# EAGLE design GF130_simple (EAGLE 9.5.2)
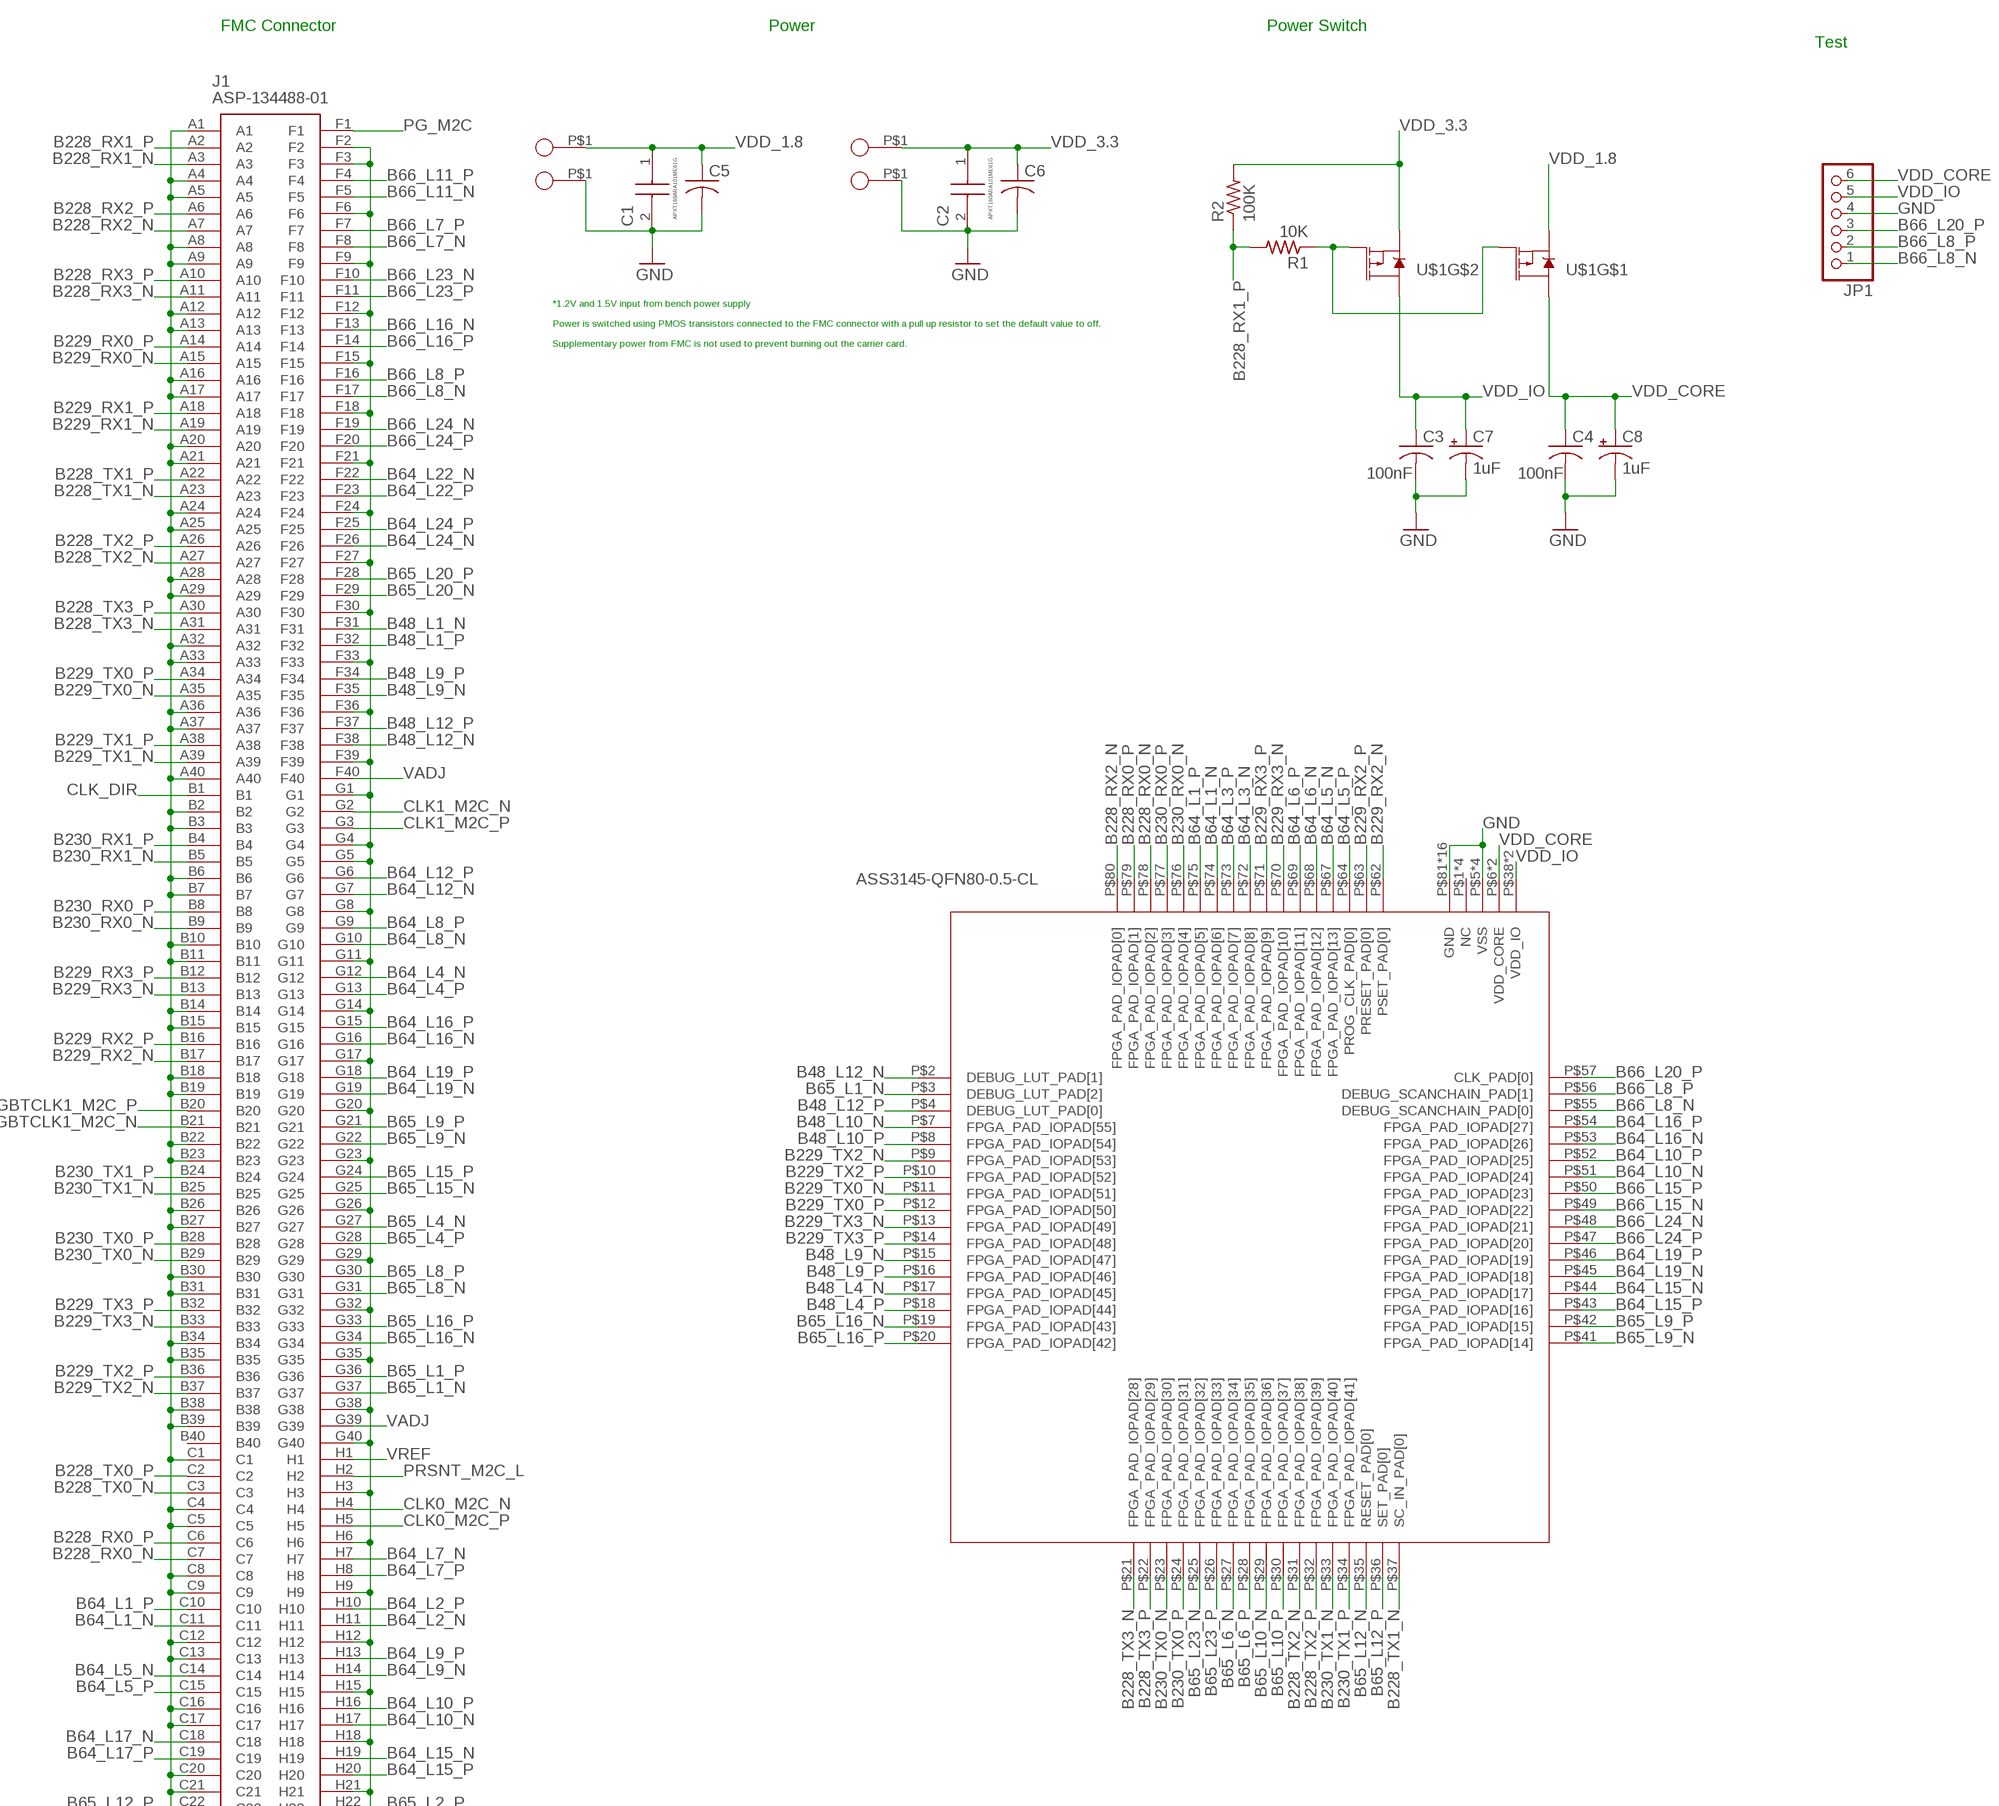
[diagram p0: schematic, sheet 1, part 1 of 2]
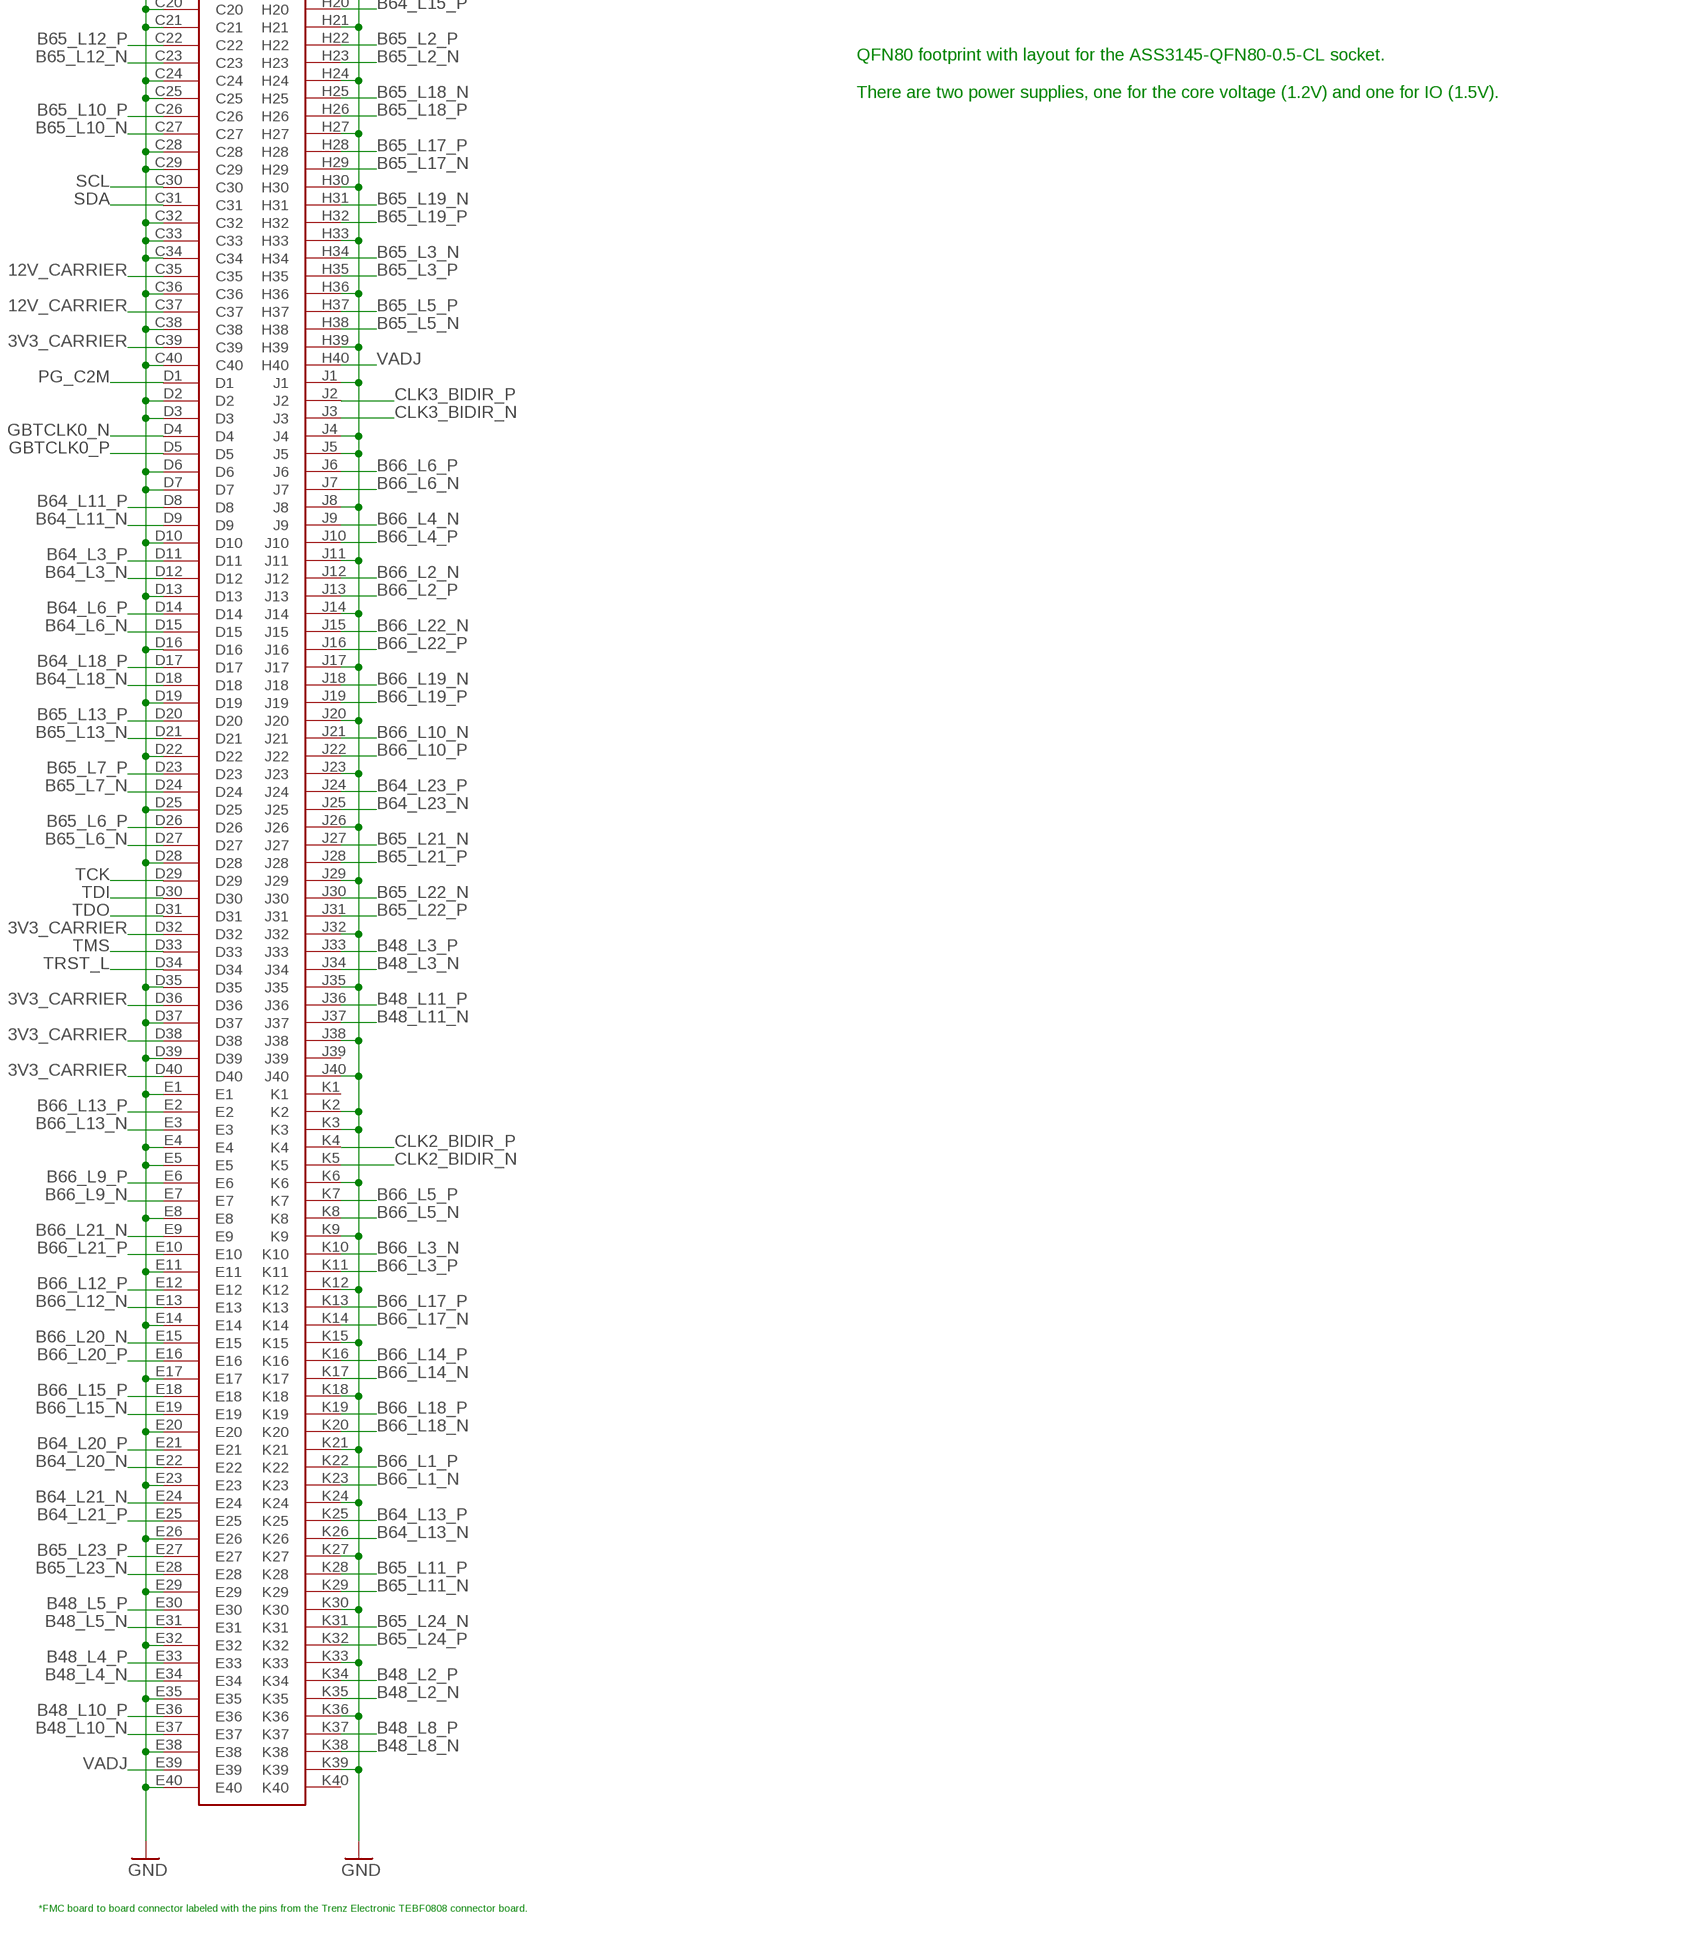
[diagram p1: schematic, sheet 1, part 2 of 2]

## Parts
C1  APXT160ARA101ME61G  [CAPAE530X610N]
C2  APXT160ARA101ME61G  [CAPAE530X610N]
C3  100nF  C-USC1210  [C1210]
C4  100nF  C-USC1210  [C1210]
C5  C-USC0805K  [C0805K]
C6  C-USC0805K  [C0805K]
C7  1uF  CPOL-USE2,5-6E  [E2,5-6E]
C8  1uF  CPOL-USE2,5-6E  [E2,5-6E]
J1  ASP-134488-01  [ASP13448801]
JP1  PINHD-1X6  [1X06]
R1  10K  R-US_R1210  [R1210]
R2  100K  R-US_R1210  [R1210]
U$1  DMP3085LSD-13  [SOIC127P600X150-8N]
U$2  QFN80  [GF130]
U$3  BANANA_JACK  [73099]
U$4  BANANA_JACK  [73099]
U$5  BANANA_JACK  [73099]
VDD  BANANA_JACK  [73099]

## Nets
3V3_CARRIER: J1.C39 J1.D32 J1.D36 J1.D38 J1.D40
12V_CARRIER: J1.C35 J1.C37
B48_L1_N: J1.F31
B48_L1_P: J1.F32
B48_L2_N: J1.K35
B48_L2_P: J1.K34
B48_L3_N: J1.J34
B48_L3_P: J1.J33
B48_L4_N: J1.E34 U$2.P$17(FPGA_PAD_IOPAD[45])
B48_L4_P: J1.E33 U$2.P$18(FPGA_PAD_IOPAD[44])
B48_L5_N: J1.E31
B48_L5_P: J1.E30
B48_L8_N: J1.K38
B48_L8_P: J1.K37
B48_L9_N: J1.F35 U$2.P$15(FPGA_PAD_IOPAD[47])
B48_L9_P: J1.F34 U$2.P$16(FPGA_PAD_IOPAD[46])
B48_L10_N: J1.E37 U$2.P$7(FPGA_PAD_IOPAD[55])
B48_L10_P: J1.E36 U$2.P$8(FPGA_PAD_IOPAD[54])
B48_L11_N: J1.J37
B48_L11_P: J1.J36
B48_L12_N: J1.F38 U$2.P$2(DEBUG_LUT_PAD[1])
B48_L12_P: J1.F37 U$2.P$4(DEBUG_LUT_PAD[0])
B64_L1_N: J1.C11 U$2.P$74(FPGA_PAD_IOPAD[6])
B64_L1_P: J1.C10 U$2.P$75(FPGA_PAD_IOPAD[5])
B64_L2_N: J1.H11
B64_L2_P: J1.H10
B64_L3_N: J1.D12 U$2.P$72(FPGA_PAD_IOPAD[8])
B64_L3_P: J1.D11 U$2.P$73(FPGA_PAD_IOPAD[7])
B64_L4_N: J1.G12
B64_L4_P: J1.G13
B64_L5_N: J1.C14 U$2.P$67(FPGA_PAD_IOPAD[13])
B64_L5_P: J1.C15 U$2.P$64(PROG_CLK_PAD[0])
B64_L6_N: J1.D15 U$2.P$68(FPGA_PAD_IOPAD[12])
B64_L6_P: J1.D14 U$2.P$69(FPGA_PAD_IOPAD[11])
B64_L7_N: J1.H7
B64_L7_P: J1.H8
B64_L8_N: J1.G10
B64_L8_P: J1.G9
B64_L9_N: J1.H14
B64_L9_P: J1.H13
B64_L10_N: J1.H17 U$2.P$51(FPGA_PAD_IOPAD[24])
B64_L10_P: J1.H16 U$2.P$52(FPGA_PAD_IOPAD[25])
B64_L11_N: J1.D9
B64_L11_P: J1.D8
B64_L12_N: J1.G7
B64_L12_P: J1.G6
B64_L13_N: J1.K26
B64_L13_P: J1.K25
B64_L15_N: J1.H19 U$2.P$44(FPGA_PAD_IOPAD[17])
B64_L15_P: J1.H20 U$2.P$43(FPGA_PAD_IOPAD[16])
B64_L16_N: J1.G16 U$2.P$53(FPGA_PAD_IOPAD[26])
B64_L16_P: J1.G15 U$2.P$54(FPGA_PAD_IOPAD[27])
B64_L17_N: J1.C18
B64_L17_P: J1.C19
B64_L18_N: J1.D18
B64_L18_P: J1.D17
B64_L19_N: J1.G19 U$2.P$45(FPGA_PAD_IOPAD[18])
B64_L19_P: J1.G18 U$2.P$46(FPGA_PAD_IOPAD[19])
B64_L20_N: J1.E22
B64_L20_P: J1.E21
B64_L21_N: J1.E24
B64_L21_P: J1.E25
B64_L22_N: J1.F22
B64_L22_P: J1.F23
B64_L23_N: J1.J25
B64_L23_P: J1.J24
B64_L24_N: J1.F26
B64_L24_P: J1.F25
B65_L1_N: J1.G37 U$2.P$3(DEBUG_LUT_PAD[2])
B65_L1_P: J1.G36
B65_L2_N: J1.H23
B65_L2_P: J1.H22
B65_L3_N: J1.H34
B65_L3_P: J1.H35
B65_L4_N: J1.G27
B65_L4_P: J1.G28
B65_L5_N: J1.H38
B65_L5_P: J1.H37
B65_L6_N: J1.D27 U$2.P$27(FPGA_PAD_IOPAD[34])
B65_L6_P: J1.D26 U$2.P$28(FPGA_PAD_IOPAD[35])
B65_L7_N: J1.D24
B65_L7_P: J1.D23
B65_L8_N: J1.G31
B65_L8_P: J1.G30
B65_L9_N: J1.G22 U$2.P$41(FPGA_PAD_IOPAD[14])
B65_L9_P: J1.G21 U$2.P$42(FPGA_PAD_IOPAD[15])
B65_L10_N: J1.C27 U$2.P$29(FPGA_PAD_IOPAD[36])
B65_L10_P: J1.C26 U$2.P$30(FPGA_PAD_IOPAD[37])
B65_L11_N: J1.K29
B65_L11_P: J1.K28
B65_L12_N: J1.C23 U$2.P$35(RESET_PAD[0])
B65_L12_P: J1.C22 U$2.P$36(SET_PAD[0])
B65_L13_N: J1.D21
B65_L13_P: J1.D20
B65_L15_N: J1.G25
B65_L15_P: J1.G24
B65_L16_N: J1.G34 U$2.P$19(FPGA_PAD_IOPAD[43])
B65_L16_P: J1.G33 U$2.P$20(FPGA_PAD_IOPAD[42])
B65_L17_N: J1.H29
B65_L17_P: J1.H28
B65_L18_N: J1.H25
B65_L18_P: J1.H26
B65_L19_N: J1.H31
B65_L19_P: J1.H32
B65_L20_N: J1.F29
B65_L20_P: J1.F28
B65_L21_N: J1.J27
B65_L21_P: J1.J28
B65_L22_N: J1.J30
B65_L22_P: J1.J31
B65_L23_N: J1.E28 U$2.P$25(FPGA_PAD_IOPAD[32])
B65_L23_P: J1.E27 U$2.P$26(FPGA_PAD_IOPAD[33])
B65_L24_N: J1.K31
B65_L24_P: J1.K32
B66_L1_N: J1.K23
B66_L1_P: J1.K22
B66_L2_N: J1.J12
B66_L2_P: J1.J13
B66_L3_N: J1.K10
B66_L3_P: J1.K11
B66_L4_N: J1.J9
B66_L4_P: J1.J10
B66_L5_N: J1.K8
B66_L5_P: J1.K7
B66_L6_N: J1.J7
B66_L6_P: J1.J6
B66_L7_N: J1.F8
B66_L7_P: J1.F7
B66_L8_N: J1.F17 JP1.1 U$2.P$55(DEBUG_SCANCHAIN_PAD[0])
B66_L8_P: J1.F16 JP1.2 U$2.P$56(DEBUG_SCANCHAIN_PAD[1])
B66_L9_N: J1.E7
B66_L9_P: J1.E6
B66_L10_N: J1.J21
B66_L10_P: J1.J22
B66_L11_N: J1.F5
B66_L11_P: J1.F4
B66_L12_N: J1.E13
B66_L12_P: J1.E12
B66_L13_N: J1.E3
B66_L13_P: J1.E2
B66_L14_N: J1.K17
B66_L14_P: J1.K16
B66_L15_N: J1.E19 U$2.P$49(FPGA_PAD_IOPAD[22])
B66_L15_P: J1.E18 U$2.P$50(FPGA_PAD_IOPAD[23])
B66_L16_N: J1.F13
B66_L16_P: J1.F14
B66_L17_N: J1.K14
B66_L17_P: J1.K13
B66_L18_N: J1.K20
B66_L18_P: J1.K19
B66_L19_N: J1.J18
B66_L19_P: J1.J19
B66_L20_N: J1.E15
B66_L20_P: J1.E16 JP1.3 U$2.P$57(CLK_PAD[0])
B66_L21_N: J1.E9
B66_L21_P: J1.E10
B66_L22_N: J1.J15
B66_L22_P: J1.J16
B66_L23_N: J1.F10
B66_L23_P: J1.F11
B66_L24_N: J1.F19 U$2.P$48(FPGA_PAD_IOPAD[21])
B66_L24_P: J1.F20 U$2.P$47(FPGA_PAD_IOPAD[20])
B228_RX0_N: J1.C7 U$2.P$78(FPGA_PAD_IOPAD[2])
B228_RX0_P: J1.C6 U$2.P$79(FPGA_PAD_IOPAD[1])
B228_RX1_N: J1.A3
B228_RX1_P: J1.A2 R1.2 R2.1
B228_RX2_N: J1.A7 U$2.P$80(FPGA_PAD_IOPAD[0])
B228_RX2_P: J1.A6
B228_RX3_N: J1.A11
B228_RX3_P: J1.A10
B228_TX0_N: J1.C3
B228_TX0_P: J1.C2
B228_TX1_N: J1.A23 U$2.P$37(SC_IN_PAD[0])
B228_TX1_P: J1.A22
B228_TX2_N: J1.A27 U$2.P$31(FPGA_PAD_IOPAD[38])
B228_TX2_P: J1.A26 U$2.P$32(FPGA_PAD_IOPAD[39])
B228_TX3_N: J1.A31 U$2.P$21(FPGA_PAD_IOPAD[28])
B228_TX3_P: J1.A30 U$2.P$22(FPGA_PAD_IOPAD[29])
B229_RX0_N: J1.A15
B229_RX0_P: J1.A14
B229_RX1_N: J1.A19
B229_RX1_P: J1.A18
B229_RX2_N: J1.B17 U$2.P$62(PSET_PAD[0])
B229_RX2_P: J1.B16 U$2.P$63(PRESET_PAD[0])
B229_RX3_N: J1.B13 U$2.P$70(FPGA_PAD_IOPAD[10])
B229_RX3_P: J1.B12 U$2.P$71(FPGA_PAD_IOPAD[9])
B229_TX0_N: J1.A35 U$2.P$11(FPGA_PAD_IOPAD[51])
B229_TX0_P: J1.A34 U$2.P$12(FPGA_PAD_IOPAD[50])
B229_TX1_N: J1.A39
B229_TX1_P: J1.A38
B229_TX2_N: J1.B37 U$2.P$9(FPGA_PAD_IOPAD[53])
B229_TX2_P: J1.B36 U$2.P$10(FPGA_PAD_IOPAD[52])
B229_TX3_N: J1.B33 U$2.P$13(FPGA_PAD_IOPAD[49])
B229_TX3_P: J1.B32 U$2.P$14(FPGA_PAD_IOPAD[48])
B230_RX0_N: J1.B9 U$2.P$76(FPGA_PAD_IOPAD[4])
B230_RX0_P: J1.B8 U$2.P$77(FPGA_PAD_IOPAD[3])
B230_RX1_N: J1.B5
B230_RX1_P: J1.B4
B230_TX0_N: J1.B29 U$2.P$23(FPGA_PAD_IOPAD[30])
B230_TX0_P: J1.B28 U$2.P$24(FPGA_PAD_IOPAD[31])
B230_TX1_N: J1.B25 U$2.P$33(FPGA_PAD_IOPAD[40])
B230_TX1_P: J1.B24 U$2.P$34(FPGA_PAD_IOPAD[41])
CLK0_M2C_N: J1.H4
CLK0_M2C_P: J1.H5
CLK1_M2C_N: J1.G2
CLK1_M2C_P: J1.G3
CLK2_BIDIR_N: J1.K5
CLK2_BIDIR_P: J1.K4
CLK3_BIDIR_N: J1.J3
CLK3_BIDIR_P: J1.J2
CLK_DIR: J1.B1
GBTCLK0_N: J1.D4
GBTCLK0_P: J1.D5
GBTCLK1_M2C_N: J1.B21
GBTCLK1_M2C_P: J1.B20
GND: C1.2(-) C2.2(-) C3.2 C4.2 C5.2 C6.2 C7.- C8.- J1.A1 J1.A4 J1.A5 J1.A8 J1.A9 J1.A12 J1.A13 J1.A16 J1.A17 J1.A20 J1.A21 J1.A24 J1.A25 J1.A28 J1.A29 J1.A32 J1.A33 J1.A36 J1.A37 J1.A40 J1.B2 J1.B3 J1.B6 J1.B7 J1.B10 J1.B11 J1.B14 J1.B15 J1.B18 J1.B19 J1.B22 J1.B23 J1.B26 J1.B27 J1.B30 J1.B31 J1.B34 J1.B35 J1.B38 J1.B39 J1.C1 J1.C4 J1.C5 J1.C8 J1.C9 J1.C12 J1.C13 J1.C16 J1.C17 J1.C20 J1.C21 J1.C24 J1.C25 J1.C28 J1.C29 J1.C32 J1.C33 J1.C34 J1.C36 J1.C38 J1.C40 J1.D2 J1.D3 J1.D6 J1.D7 J1.D10 J1.D13 J1.D16 J1.D19 J1.D22 J1.D25 J1.D28 J1.D35 J1.D37 J1.D39 J1.E1 J1.E4 J1.E5 J1.E8 J1.E11 J1.E14 J1.E17 J1.E20 J1.E23 J1.E26 J1.E29 J1.E32 J1.E35 J1.E38 J1.E40 J1.F2 J1.F3 J1.F6 J1.F9 J1.F12 J1.F15 J1.F18 J1.F21 J1.F24 J1.F27 J1.F30 J1.F33 J1.F36 J1.F39 J1.G1 J1.G4 J1.G5 J1.G8 J1.G11 J1.G14 J1.G17 J1.G20 J1.G23 J1.G26 J1.G29 J1.G32 J1.G35 J1.G38 J1.G40 J1.H3 J1.H6 J1.H9 J1.H12 J1.H15 J1.H18 J1.H21 J1.H24 J1.H27 J1.H30 J1.H33 J1.H36 J1.H39 J1.J1 J1.J4 J1.J5 J1.J8 J1.J11 J1.J14 J1.J17 J1.J20 J1.J23 J1.J26 J1.J29 J1.J32 J1.J35 J1.J38 J1.J40 J1.K2 J1.K3 J1.K6 J1.K9 J1.K12 J1.K15 J1.K18 J1.K21 J1.K24 J1.K27 J1.K30 J1.K33 J1.K36 J1.K39 JP1.4 U$2.P$5(VSS) U$2.P$39(VSS) U$2.P$59(VSS) U$2.P$65(VSS) U$2.P$81(GND) U$2.P$82(GND) U$2.P$83(GND) U$2.P$84(GND) U$2.P$85(GND) U$2.P$86(GND) U$2.P$87(GND) U$2.P$88(GND) U$2.P$89(GND) U$2.P$90(GND) U$2.P$91(GND) U$2.P$92(GND) U$2.P$93(GND) U$2.P$94(GND) U$2.P$95(GND) U$2.P$96(GND) U$3.P$1 U$5.P$1
N$2: R1.1 U$1.2(G) U$1.4(G)
PG_C2M: J1.D1
PG_M2C: J1.F1
PRSNT_M2C_L: J1.H2
SCL: J1.C30
SDA: J1.C31
TCK: J1.D29
TDI: J1.D30
TDO: J1.D31
TMS: J1.D33
TRST_L: J1.D34
VADJ: J1.E39 J1.F40 J1.G39 J1.H40
VDD_1.8: C1.1(+) C5.1 U$1.1(S) VDD.P$1
VDD_3.3: C2.1(+) C6.1 R2.2 U$1.3(S) U$4.P$1
VDD_CORE: C4.1 C8.+ JP1.6 U$1.7(D) U$1.8(D) U$2.P$6(VDD_CORE) U$2.P$58(VDD_CORE)
VDD_IO: C3.1 C7.+ JP1.5 U$1.5(D) U$1.6(D) U$2.P$38(VDD_IO) U$2.P$66(VDD_IO)
VREF: J1.H1
Unconnected: J1.B40 J1.J39 J1.K1 J1.K40 U$2.P$1(NC) U$2.P$40(NC) U$2.P$60(NC) U$2.P$61(NC)

## Notes on the sheet
- FMC Connector | Power | Power Switch
- Test
- *1.2V and 1.5V input from bench power supply
  
  Power is switched using PMOS transistors connected to the FMC connector with a pull up resistor to set the default value to off.
  
  Supplementary power from FMC is not used to prevent burning out the carrier card.
- QFN80 footprint with layout for the ASS3145-QFN80-0.5-CL socket. 
  
  There are two power supplies, one for the core voltage (1.2V) and one for IO (1.5V).
- *FMC board to board connector labeled with the pins from the Trenz Electronic TEBF0808 connector board.

## Power pins joined to a net without a drawn wire
GND: U$3.P$2(GND) U$3.P$3(GND) U$3.P$4(GND) U$3.P$5(GND) U$4.P$2(GND) U$4.P$3(GND) U$4.P$4(GND) U$4.P$5(GND) U$5.P$2(GND) U$5.P$3(GND) U$5.P$4(GND) U$5.P$5(GND) VDD.P$2(GND) VDD.P$3(GND) VDD.P$4(GND) VDD.P$5(GND)

## Library data of the parts
C1 C2 = SamacSys_Parts:APXT160ARA101ME61G: Aluminum Organic Polymer Capacitors 100uF 16V Source: Datasheet; DESCRIPTION: Aluminum Organic Polymer Capacitors 100uF 16V; HEIGHT: 6.1mm; MANUFACTURER_NAME: United Chemi-Con; MANUFACTURER_PART_NUMBER: APXT160ARA101ME61G; MOUSER_PART_NUMBER: 661-APXT160A101ME61G; MOUSER_PRICE-STOCK: https://www.mouser.co.uk/ProductDetail/United-Chemi-Con/APXT160ARA101ME61G?qs=GBLSl2Akirsip577GuQBxg%3D%3D
C3-C6 = rcl:C-US: CAPACITOR, American symbol; SPICEPREFIX: C
C7 C8 = rcl:CPOL-US: POLARIZED CAPACITOR, American symbol; SPICEPREFIX: C
J1 = SamacSys_Parts:ASP-134488-01: SAMTEC - ASP-134488-01 - CONN, VITA 57 FMC, HEADER, 400POS, 10ROW Source: Datasheet <http://suddendocs.samtec.com/prints/asp-134488-01-mkt.pdf>; DESCRIPTION: SAMTEC - ASP-134488-01 - CONN, VITA 57 FMC, HEADER, 400POS, 10ROW; HEIGHT: 7.11mm; MANUFACTURER_NAME: SAMTEC; MANUFACTURER_PART_NUMBER: ASP-134488-01; MOUSER_PART_NUMBER: 200-ASP-134488-01; MOUSER_PRICE-STOCK: https://www.mouser.co.uk/ProductDetail/Samtec/ASP-134488-01?qs=jyzYFa4oMQiB2Frr%252B13AUg%3D%3D
JP1 = adafruit:PINHD-1X6: PIN HEADER
R1 R2 = rcl:R-US_: RESISTOR, American symbol; SPICEPREFIX: R
U$1 = DMP3085LSD:DMP3085LSD-13
U$2 = ASS3145-QFN80-0.5-CL:QFN80
U$3-U$5 VDD = 73099:BANANA_JACK

## Board
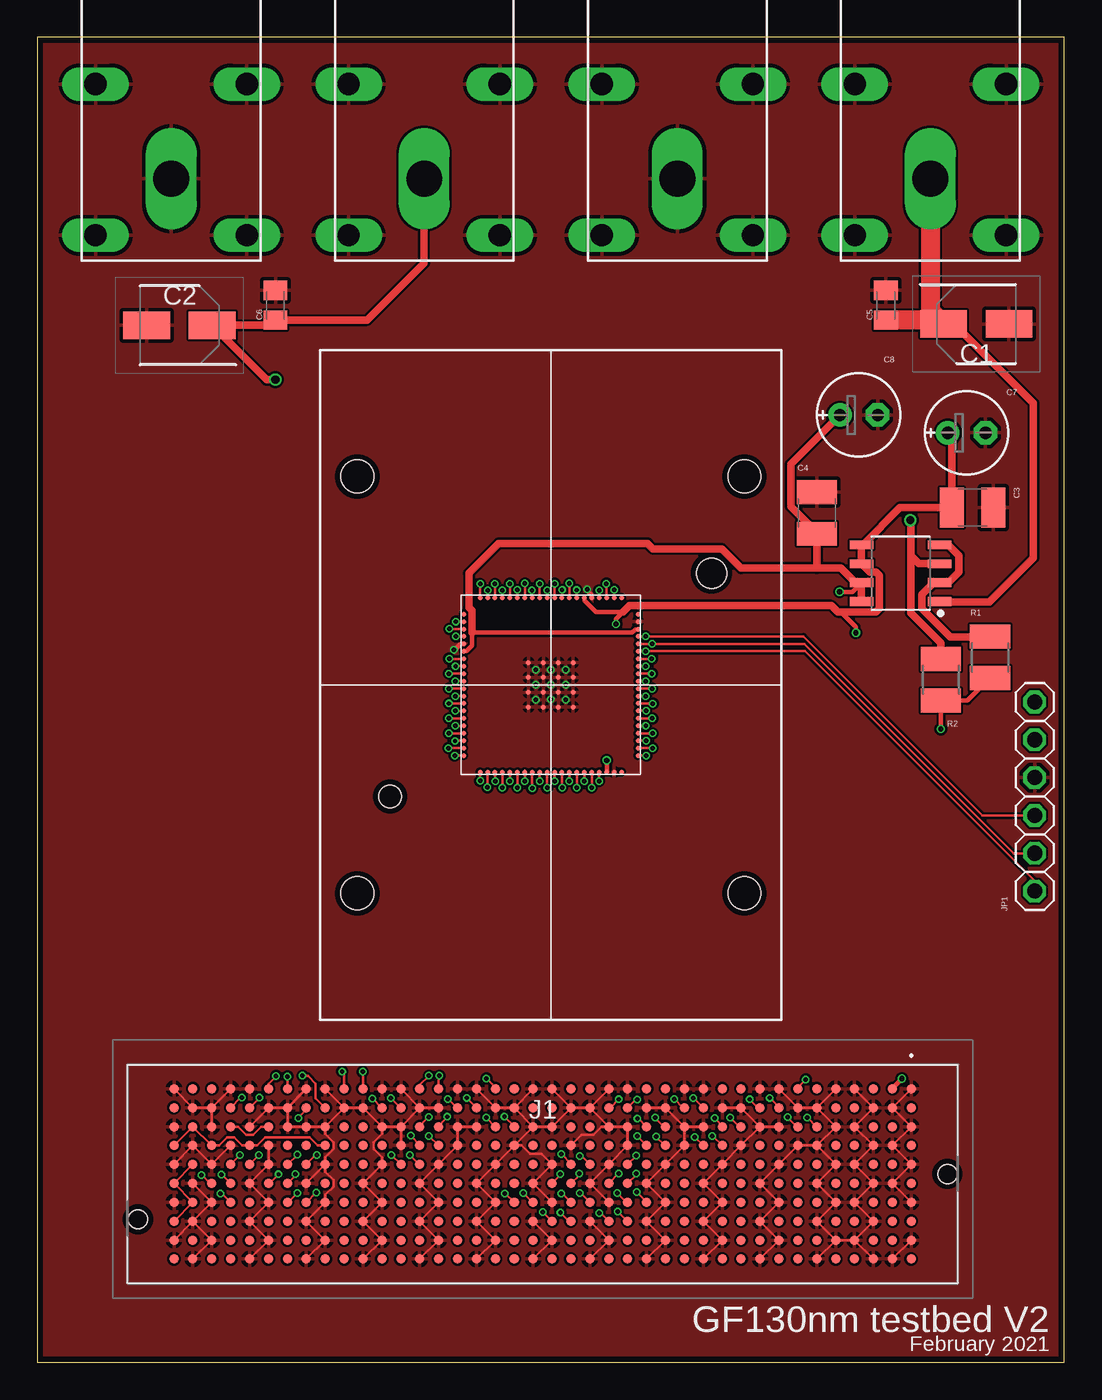
[diagram p2: board, top side]
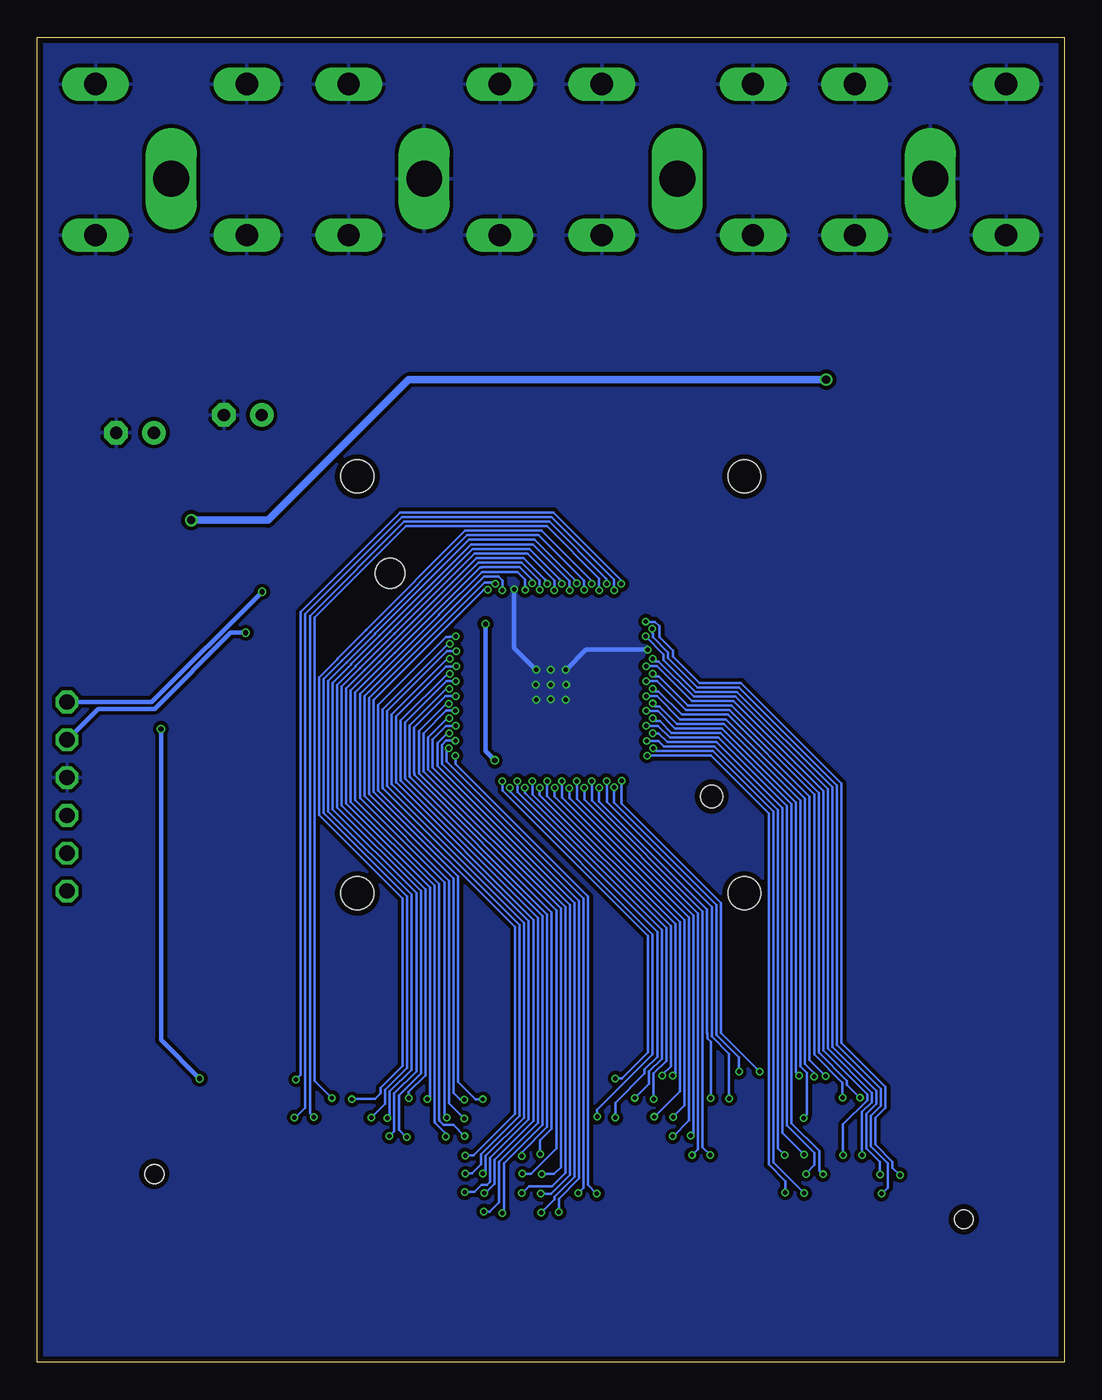
[diagram p3: board, bottom side, seen from below]

Size 69 x 89 mm. Coordinates in mm from the lower left corner, seen from the top.
Outline: 69,89 0,89 0,0 69,0 69,89
Copper layers (1*2+15*16): Top 0.0356mm / dielectric 0.1702mm / Route2 0.0178mm / dielectric 47mil / Route15 0.0178mm / dielectric 0.1702mm / Bottom 0.0356mm
Design rules "default *": minimum track width 4mil, minimum drill 0.3mm, track to track 6mil, track to pad 6mil, pad to pad 6mil, via to via 6mil, smd to smd 0mil, copper to edge 15mil, drill to drill 6mil, minimum pad ring 6mil, minimum via ring 4mil, stop-mask expansion 4mil, vias tented up to drill 0mil, thermal gap 10mil

### Footprints (pad centres in the part's own frame; a part is rotated, then mirrored left to right if it is on the bottom)
CAPAE530X610N = smd 3.15 x 1.85: 1 -2.2,0; 2 2.2,0
C1210 = smd 1.6 x 2.7: 1 -1.4,0; 2 1.4,0
C0805K = smd 1.3 x 1.6: 1 -1,0; 2 1,0
E2,5-6E = drill 0.813 pad 1.575: + -1.27,0 | drill 0.813 pad 1.575 octagon: - 1.27,0
ASP13448801 = smd 0.64 x 0.64: A1 24.765,5.715; A2 23.495,5.715; A3 22.225,5.715; A4 20.955,5.715; A5 19.685,5.715; A6 18.415,5.715; A7 17.145,5.715; A8 15.875,5.715; A9 14.605,5.715; A10 13.335,5.715; A11 12.065,5.715; A12 10.795,5.715; A13 9.525,5.715; A14 8.255,5.715; A15 6.985,5.715; A16 5.715,5.715; A17 4.445,5.715; A18 3.175,5.715; A19 1.905,5.715; A20 0.635,5.715; A21 -0.635,5.715; A22 -1.905,5.715; A23 -3.175,5.715; A24 -4.445,5.715; A25 -5.715,5.715; A26 -6.985,5.715; A27 -8.255,5.715; A28 -9.525,5.715; A29 -10.795,5.715; A30 -12.065,5.715; A31 -13.335,5.715; A32 -14.605,5.715; A33 -15.875,5.715; A34 -17.145,5.715; A35 -18.415,5.715; A36 -19.685,5.715; A37 -20.955,5.715; A38 -22.225,5.715; A39 -23.495,5.715; A40 -24.765,5.715; B1 24.765,4.445; B2 23.495,4.445; B3 22.225,4.445; B4 20.955,4.445; B5 19.685,4.445; B6 18.415,4.445; B7 17.145,4.445; B8 15.875,4.445; B9 14.605,4.445; B10 13.335,4.445; B11 12.065,4.445; B12 10.795,4.445; B13 9.525,4.445; B14 8.255,4.445; B15 6.985,4.445; B16 5.715,4.445; B17 4.445,4.445; B18 3.175,4.445; B19 1.905,4.445; B20 0.635,4.445; B21 -0.635,4.445; B22 -1.905,4.445; B23 -3.175,4.445; B24 -4.445,4.445; B25 -5.715,4.445; B26 -6.985,4.445; B27 -8.255,4.445; B28 -9.525,4.445; B29 -10.795,4.445; B30 -12.065,4.445; B31 -13.335,4.445; B32 -14.605,4.445; B33 -15.875,4.445; B34 -17.145,4.445; B35 -18.415,4.445; B36 -19.685,4.445; B37 -20.955,4.445; B38 -22.225,4.445; B39 -23.495,4.445; B40 -24.765,4.445; C1 24.765,3.175; C2 23.495,3.175; C3 22.225,3.175; C4 20.955,3.175; C5 19.685,3.175; C6 18.415,3.175; C7 17.145,3.175; C8 15.875,3.175; C9 14.605,3.175; C10 13.335,3.175; C11 12.065,3.175; C12 10.795,3.175; C13 9.525,3.175; C14 8.255,3.175; C15 6.985,3.175; C16 5.715,3.175; C17 4.445,3.175; C18 3.175,3.175; C19 1.905,3.175; C20 0.635,3.175; C21 -0.635,3.175; C22 -1.905,3.175; C23 -3.175,3.175; C24 -4.445,3.175; C25 -5.715,3.175; C26 -6.985,3.175; C27 -8.255,3.175; C28 -9.525,3.175; C29 -10.795,3.175; C30 -12.065,3.175; C31 -13.335,3.175; C32 -14.605,3.175; C33 -15.875,3.175; C34 -17.145,3.175; C35 -18.415,3.175; C36 -19.685,3.175; C37 -20.955,3.175; C38 -22.225,3.175; C39 -23.495,3.175; C40 -24.765,3.175; D1 24.765,1.905; D2 23.495,1.905; D3 22.225,1.905; D4 20.955,1.905; D5 19.685,1.905; D6 18.415,1.905; D7 17.145,1.905; D8 15.875,1.905; D9 14.605,1.905; D10 13.335,1.905; D11 12.065,1.905; D12 10.795,1.905; D13 9.525,1.905; D14 8.255,1.905; D15 6.985,1.905; D16 5.715,1.905; D17 4.445,1.905; D18 3.175,1.905; D19 1.905,1.905; D20 0.635,1.905; D21 -0.635,1.905; D22 -1.905,1.905; D23 -3.175,1.905; D24 -4.445,1.905; D25 -5.715,1.905; D26 -6.985,1.905; D27 -8.255,1.905; D28 -9.525,1.905; D29 -10.795,1.905; D30 -12.065,1.905; D31 -13.335,1.905; D32 -14.605,1.905; D33 -15.875,1.905; D34 -17.145,1.905; D35 -18.415,1.905; D36 -19.685,1.905; D37 -20.955,1.905; D38 -22.225,1.905; D39 -23.495,1.905; D40 -24.765,1.905; E1 24.765,0.635; E2 23.495,0.635; E3 22.225,0.635; E4 20.955,0.635; E5 19.685,0.635; E6 18.415,0.635; E7 17.145,0.635; E8 15.875,0.635; E9 14.605,0.635; E10 13.335,0.635; E11 12.065,0.635; E12 10.795,0.635; E13 9.525,0.635; E14 8.255,0.635; E15 6.985,0.635; E16 5.715,0.635; E17 4.445,0.635; E18 3.175,0.635; E19 1.905,0.635; E20 0.635,0.635; E21 -0.635,0.635; E22 -1.905,0.635; E23 -3.175,0.635; E24 -4.445,0.635; E25 -5.715,0.635; E26 -6.985,0.635; E27 -8.255,0.635; E28 -9.525,0.635; E29 -10.795,0.635; E30 -12.065,0.635; E31 -13.335,0.635; E32 -14.605,0.635; E33 -15.875,0.635; E34 -17.145,0.635; E35 -18.415,0.635; E36 -19.685,0.635; E37 -20.955,0.635; E38 -22.225,0.635; E39 -23.495,0.635; E40 -24.765,0.635; F1 24.765,-0.635; F2 23.495,-0.635; F3 22.225,-0.635; F4 20.955,-0.635; F5 19.685,-0.635; F6 18.415,-0.635; F7 17.145,-0.635; F8 15.875,-0.635; F9 14.605,-0.635; F10 13.335,-0.635; F11 12.065,-0.635; F12 10.795,-0.635; F13 9.525,-0.635; F14 8.255,-0.635; F15 6.985,-0.635; F16 5.715,-0.635; F17 4.445,-0.635; F18 3.175,-0.635; F19 1.905,-0.635; F20 0.635,-0.635; F21 -0.635,-0.635; F22 -1.905,-0.635; F23 -3.175,-0.635; F24 -4.445,-0.635; F25 -5.715,-0.635; F26 -6.985,-0.635; F27 -8.255,-0.635; F28 -9.525,-0.635; F29 -10.795,-0.635; F30 -12.065,-0.635; F31 -13.335,-0.635; F32 -14.605,-0.635; F33 -15.875,-0.635; F34 -17.145,-0.635; F35 -18.415,-0.635; F36 -19.685,-0.635; F37 -20.955,-0.635; F38 -22.225,-0.635; F39 -23.495,-0.635; F40 -24.765,-0.635; G1 24.765,-1.905; G2 23.495,-1.905; G3 22.225,-1.905; G4 20.955,-1.905; G5 19.685,-1.905; G6 18.415,-1.905; G7 17.145,-1.905; G8 15.875,-1.905; G9 14.605,-1.905; G10 13.335,-1.905; G11 12.065,-1.905; G12 10.795,-1.905; G13 9.525,-1.905; G14 8.255,-1.905; G15 6.985,-1.905; G16 5.715,-1.905; G17 4.445,-1.905; G18 3.175,-1.905; G19 1.905,-1.905; G20 0.635,-1.905; G21 -0.635,-1.905; G22 -1.905,-1.905; G23 -3.175,-1.905; G24 -4.445,-1.905; G25 -5.715,-1.905; G26 -6.985,-1.905; G27 -8.255,-1.905; G28 -9.525,-1.905; G29 -10.795,-1.905; G30 -12.065,-1.905; G31 -13.335,-1.905; G32 -14.605,-1.905; G33 -15.875,-1.905; G34 -17.145,-1.905; G35 -18.415,-1.905; G36 -19.685,-1.905; G37 -20.955,-1.905; G38 -22.225,-1.905; G39 -23.495,-1.905; G40 -24.765,-1.905; H1 24.765,-3.175; H2 23.495,-3.175; H3 22.225,-3.175; H4 20.955,-3.175; H5 19.685,-3.175; H6 18.415,-3.175; H7 17.145,-3.175; H8 15.875,-3.175; H9 14.605,-3.175; H10 13.335,-3.175; H11 12.065,-3.175; H12 10.795,-3.175; H13 9.525,-3.175; H14 8.255,-3.175; H15 6.985,-3.175; H16 5.715,-3.175; H17 4.445,-3.175; H18 3.175,-3.175; H19 1.905,-3.175; H20 0.635,-3.175; H21 -0.635,-3.175; H22 -1.905,-3.175; H23 -3.175,-3.175; H24 -4.445,-3.175; H25 -5.715,-3.175; H26 -6.985,-3.175; H27 -8.255,-3.175; H28 -9.525,-3.175; H29 -10.795,-3.175; H30 -12.065,-3.175; H31 -13.335,-3.175; H32 -14.605,-3.175; H33 -15.875,-3.175; H34 -17.145,-3.175; H35 -18.415,-3.175; H36 -19.685,-3.175; H37 -20.955,-3.175; H38 -22.225,-3.175; H39 -23.495,-3.175; H40 -24.765,-3.175; J1 24.765,-4.445; J2 23.495,-4.445; J3 22.225,-4.445; J4 20.955,-4.445; J5 19.685,-4.445; J6 18.415,-4.445; J7 17.145,-4.445; J8 15.875,-4.445; J9 14.605,-4.445; J10 13.335,-4.445; J11 12.065,-4.445; J12 10.795,-4.445; J13 9.525,-4.445; J14 8.255,-4.445; J15 6.985,-4.445; J16 5.715,-4.445; J17 4.445,-4.445; J18 3.175,-4.445; J19 1.905,-4.445; J20 0.635,-4.445; J21 -0.635,-4.445; J22 -1.905,-4.445; J23 -3.175,-4.445; J24 -4.445,-4.445; J25 -5.715,-4.445; J26 -6.985,-4.445; J27 -8.255,-4.445; J28 -9.525,-4.445; J29 -10.795,-4.445; J30 -12.065,-4.445; J31 -13.335,-4.445; J32 -14.605,-4.445; J33 -15.875,-4.445; J34 -17.145,-4.445; J35 -18.415,-4.445; J36 -19.685,-4.445; J37 -20.955,-4.445; J38 -22.225,-4.445; J39 -23.495,-4.445; J40 -24.765,-4.445; K1 24.765,-5.715; K2 23.495,-5.715; K3 22.225,-5.715; K4 20.955,-5.715; K5 19.685,-5.715; K6 18.415,-5.715; K7 17.145,-5.715; K8 15.875,-5.715; K9 14.605,-5.715; K10 13.335,-5.715; K11 12.065,-5.715; K12 10.795,-5.715; K13 9.525,-5.715; K14 8.255,-5.715; K15 6.985,-5.715; K16 5.715,-5.715; K17 4.445,-5.715; K18 3.175,-5.715; K19 1.905,-5.715; K20 0.635,-5.715; K21 -0.635,-5.715; K22 -1.905,-5.715; K23 -3.175,-5.715; K24 -4.445,-5.715; K25 -5.715,-5.715; K26 -6.985,-5.715; K27 -8.255,-5.715; K28 -9.525,-5.715; K29 -10.795,-5.715; K30 -12.065,-5.715; K31 -13.335,-5.715; K32 -14.605,-5.715; K33 -15.875,-5.715; K34 -17.145,-5.715; K35 -18.415,-5.715; K36 -19.685,-5.715; K37 -20.955,-5.715; K38 -22.225,-5.715; K39 -23.495,-5.715; K40 -24.765,-5.715 | hole 1.27: 27.189,0; -27.191,-3.05
1X06 = drill 1.016 octagon: 1 -6.35,0; 2 -3.81,0; 3 -1.27,0; 4 1.27,0; 5 3.81,0; 6 6.35,0
R1210 = smd 1.6 x 2.7: 1 -1.4,0; 2 1.4,0
SOIC127P600X150-8N = smd 1.58 x 0.589: 1 -2.625,1.905; 2 -2.625,0.635; 3 -2.625,-0.635; 4 -2.625,-1.905; 5 2.625,-1.905; 6 2.625,-0.635; 7 2.625,0.635; 8 2.625,1.905
GF130 = smd 0.34 x 0.34: P$1 9.64,-17.75; P$2 9.64,-18.25; P$3 9.64,-18.75; P$4 9.64,-19.25; P$5 9.64,-19.75; P$6 9.64,-20.25; P$7 9.64,-20.75; P$8 9.64,-21.25; P$9 9.64,-21.75; P$10 9.64,-22.25; P$11 9.64,-22.75; P$12 9.64,-23.25; P$13 9.64,-23.75; P$14 9.64,-24.25; P$15 9.64,-24.75; P$16 9.64,-25.25; P$17 9.64,-25.75; P$18 9.64,-26.25; P$19 9.64,-26.75; P$20 9.64,-27.25; P$21 10.75,-28.36; P$22 11.25,-28.36; P$23 11.75,-28.36; P$24 12.25,-28.36; P$25 12.75,-28.36; P$26 13.25,-28.36; P$27 13.75,-28.36; P$28 14.25,-28.36; P$29 14.75,-28.36; P$30 15.25,-28.36; P$31 15.75,-28.36; P$32 16.25,-28.36; P$33 16.75,-28.36; P$34 17.25,-28.36; P$35 17.75,-28.36; P$36 18.25,-28.36; P$37 18.75,-28.36; P$38 19.25,-28.36; P$39 19.75,-28.36; P$40 20.25,-28.36; P$41 21.37,-27.25; P$42 21.37,-26.75; P$43 21.37,-26.25; P$44 21.37,-25.75; P$45 21.37,-25.25; P$46 21.37,-24.75; P$47 21.37,-24.25; P$48 21.37,-23.75; P$49 21.37,-23.25; P$50 21.37,-22.75; P$51 21.37,-22.25; P$52 21.37,-21.75; P$53 21.37,-21.25; P$54 21.37,-20.75; P$55 21.37,-20.25; P$56 21.37,-19.75; P$57 21.37,-19.25; P$58 21.37,-18.75; P$59 21.37,-18.25; P$60 21.37,-17.75; P$61 20.25,-16.65; P$62 19.75,-16.65; P$63 19.25,-16.65; P$64 18.75,-16.65; P$65 18.25,-16.65; P$66 17.75,-16.65; P$67 17.25,-16.65; P$68 16.75,-16.65; P$69 16.25,-16.65; P$70 15.75,-16.65; P$71 15.25,-16.65; P$72 14.75,-16.65; P$73 14.25,-16.65; P$74 13.75,-16.65; P$75 13.25,-16.65; P$76 12.75,-16.65; P$77 12.25,-16.65; P$78 11.75,-16.65; P$79 11.25,-16.65; P$80 10.75,-16.65; P$81 16,-22; P$82 16,-23; P$83 15,-23; P$84 15,-22; P$85 15,-21; P$86 16,-21; P$87 17,-21; P$88 17,-22; P$89 17,-23; P$90 17,-24; P$91 16,-24; P$92 15,-24; P$93 14,-24; P$94 14,-23; P$95 14,-22; P$96 14,-21 | hole 1.5: 4.7,-30 | hole 2.2: 2.5,-36.5; 28.5,-36.5; 28.5,-8.5; 2.5,-8.5 | hole 2: 26.3,-15
73099 = drill 2.4 long: P$1 6,5.5 | drill 1.5 long: P$2 11.08,11.86; P$3 0.92,11.86; P$4 0.92,1.7; P$5 11.08,1.7

### Placement (x,y rotation side)
C1  63.08,69.74 0 top
C2  9.56,69.65 180 top
C3  62.83,57.41 0 top
C4  52.37,57.05 90 top
C5  57,71 90 top
C6  16,71 90 top
C7  62.43,62.43 0 top
C8  55.19,63.63 0 top
J1  33.95,12.65 0 top
JP1  67,38 90 top
R1  64,47.35 270 top
R2  60.7,45.84 90 top
U$1  58,53 180 top
U$2  19,68 0 top
U$3  37,74 0 top
U$4  20,74 0 top
U$5  3,74 0 top
VDD  54,74 0 top

### Tracks (layer width: path | path; a pad name or v marks a point on that pad's centre or on a via)
3V3_CARRIER
  Top 0.152: J1.D40 J1.C39 J1.D38 12.22,14.55 12.77,15.1 13.22,15.1 13.77,14.55 J1.D36 14.76,14.55 15.31,15.1 18.3,15.1 18.85,14.55 J1.D32
12V_CARRIER
  Top 0.152: J1.C37 13.49,15.82 14.04,15.28 14.49,15.28 15.04,15.82 J1.C35
B48_L4_N  (via drill 0.3)
  Top 0.152: U$2.P$17 v27.66,42.25 | v27.66,42.25 | v17.48,13.95 J1.E34
  Bottom 0.152: v27.66,42.25 27.26,42.25 26.67,41.66 23.37,41.66 18.95,37.24 18.95,15.42 v17.48,13.95
B48_L4_P  (via drill 0.3)
  Top 0.152: U$2.P$18 28.09,41.75 v28.07,41.73 | v18.79,13.92 18.71,13.92 J1.E33
  Bottom 0.152: v28.07,41.73 27.82,41.73 27.42,41.73 27.41,41.73 27.28,41.73 26.91,41.36 23.5,41.36 19.25,37.11 19.25,14.38 v18.79,13.92
B48_L9_N  (via drill 0.3)
  Top 0.152: U$2.P$15 v27.65,43.25 | v16.21,12.62 15.61,12.02 J1.F35
  Bottom 0.152: v27.65,43.25 27.46,43.06 27.17,43.06 26.38,42.27 23.12,42.27 18.34,37.49 18.34,16.05 16.48,14.19 16.48,12.88 v16.22,12.62 v16.21,12.62
B48_L9_P  (via drill 0.3)
  Top 0.152: U$2.P$16 v28.09,42.75 v28.08,42.75 | v17.36,12.64 17.36,12.56 J1.F34
  Bottom 0.152: v28.08,42.75 27.29,42.75 26.51,41.97 23.25,41.97 18.64,37.37 18.64,15.92 16.78,14.06 16.78,13.25 17.37,12.66 v17.36,12.64
B48_L10_N  (via drill 0.3)
  Top 0.152: U$2.P$7 v27.67,47.25 | v13.6,13.91 13.6,13.89 J1.E37
  Bottom 0.152: v27.67,47.25 27.48,47.06 27.25,47.06 24.9,44.71 22.11,44.71 15.9,38.5 15.9,21.07 12.94,18.11 12.94,17.47 13.6,16.8 13.6,13.92 v13.6,13.92 v13.6,13.91
B48_L10_P  (via drill 0.3)
  Top 0.152: U$2.P$8 v28.11,46.75 v28.1,46.76 | v14.88,13.93 14.88,13.9 J1.E36
  Bottom 0.152: v28.1,46.76 27.38,46.76 25.03,44.41 22.23,44.41 16.2,38.38 16.2,20.94 13.24,17.98 13.24,17.6 14.87,15.97 v14.87,13.93 v14.88,13.93
B48_L12_N  (via drill 0.3)
  Top 0.152: U$2.P$2 v28.13,49.75 v28.12,49.75 | v11.04,12.59 11.62,12.02 J1.F38
  Bottom 0.152: v28.12,49.75 28,49.63 27.89,49.73 27.5,49.73 27.22,49.45 27.22,48.71 26.31,47.8 26.31,47.41 24.52,45.63 21.73,45.63 14.98,38.88 14.98,21.45 12.02,18.48 12.02,17.09 12.69,16.43 12.69,14.62 11.54,13.48 11.54,13.07 v11.05,12.58 v11.04,12.59
B48_L12_P  (via drill 0.3)
  Top 0.152: U$2.P$4 v28.12,48.75 | v12.38,12.62 v12.39,12.62 J1.F37
  Bottom 0.152: v28.12,48.75 26.92,47.55 26.92,47.16 24.77,45.02 21.98,45.02 15.59,38.63 15.59,21.2 12.63,18.23 12.63,17.35 13.3,16.68 13.3,14.37 12.39,13.46 v12.39,12.62 v12.38,12.62
B64_L1_N  (via drill 0.3)
  Top 0.152: U$2.P$74 v32.75,52.31 | v45.49,16.41 46.02,15.89 J1.C11
  Bottom 0.152: v32.75,52.31 v32.74,52.32 32.74,52.4 35.58,55.24 39.94,55.24 40,55.24 46.3,48.94 46.3,48.93 48.22,47.02 48.22,47 49.46,45.76 49.46,37.01 43.86,31.41 43.86,19.64 45.32,18.18 45.32,16.53 45.44,16.41 v45.49,16.41
B64_L1_P  (via drill 0.3)
  Top 0.152: U$2.P$75 v32.25,51.87 v32.26,51.88 | v46.56,16.42 47.16,15.82 J1.C10
  Bottom 0.152: v32.26,51.88 32.26,52.49 35.31,55.55 40.06,55.55 40.12,55.55 46.61,49.06 48.52,47.14 48.52,47.12 49.77,45.88 49.77,36.89 44.16,31.29 44.16,19.77 45.62,18.31 45.62,17.36 v46.56,16.42
B64_L3_N  (via drill 0.3)
  Top 0.152: U$2.P$72 v33.75,52.28 | v44.17,15.12 v44.18,15.12 J1.D12
  Bottom 0.152: v33.75,52.28 33.75,52.44 33.92,52.6 33.92,52.61 35.94,54.63 39.75,54.63 45.3,49.08 45.3,49.07 47.61,46.76 47.61,46.75 48.85,45.51 48.85,37.27 43.23,31.64 43.23,19.41 44.71,17.93 44.71,15.62 44.21,15.12 v44.17,15.12
B64_L3_P  (via drill 0.3)
  Top 0.152: U$2.P$73 33.24,51.36 v33.24,51.87 | v45.34,15.18 45.39,15.18 J1.D11
  Bottom 0.152: v33.24,51.87 33.24,52.47 35.71,54.94 39.81,54.94 | 39.81,54.94 | 39.81,54.94 39.87,54.94 46,48.81 46,48.8 47.91,46.89 47.91,46.87 49.16,45.63 49.16,37.14 43.53,31.52 43.53,19.54 45.02,18.06 45.02,15.51 v45.34,15.18
B64_L5_N  (via drill 0.3)
  Top 0.152: U$2.P$67 36.23,51.37 v36.23,51.87 | v41.5,16.42 42.09,15.82 J1.C14
  Bottom 0.152: v36.23,51.87 36.23,52.57 36.75,53.09 39.12,53.09 42,50.21 42,50.2 47.33,44.87 47.33,37.9 41.65,32.22 41.65,16.59 41.5,16.43 v41.5,16.42
B64_L5_P  (via drill 0.3)
  Top 0.152: U$2.P$64 v37.75,51.85 | v40.32,16.38 40.38,16.38 J1.C15
  Bottom 0.152: v37.75,51.85 37.75,52.49 38.03,52.77 39,52.77 47.02,44.75 47.02,38.02 41.34,32.34 41.34,17.4 v40.32,16.38
B64_L6_N  (via drill 0.3)
  Top 0.152: U$2.P$68 v35.74,52.31 | v40.3,15.19 J1.D15
  Bottom 0.152: v35.74,52.31 35.74,52.54 36.6,53.4 39.16,53.4 39.25,53.4 45,47.64 45,47.63 47.63,45 47.63,37.77 42,32.14 42,16.29 41.98,16.27 41.98,16.22 41.7,15.94 41.04,15.94 v40.29,15.19 v40.3,15.19
B64_L6_P  (via drill 0.3)
  Top 0.152: U$2.P$69 v35.25,51.87 | v41.57,15.15 42.16,14.55 J1.D14
  Bottom 0.152: v35.25,51.87 35.25,52.5 36.46,53.71 39.37,53.71 46,47.08 46,47.06 47.94,45.13 47.94,37.64 42.3,32.01 42.3,16.16 42.28,16.14 42.28,16.09 41.57,15.38 v41.57,15.15
B64_L10_N  (via drill 0.3)
  Top 0.152: U$2.P$51 v40.87,45.75 v40.88,45.74 | v37.76,10.03 37.84,10.03 J1.H17
  Bottom 0.152: v40.88,45.74 41.51,45.74 44.28,42.97 44.28,39.3 | 44.28,39.3 | 44.28,39.3 44.28,39.21 44.26,39.19 44.26,39.18 35.05,29.97 35.05,15.96 37.66,13.35 37.66,10.12 v37.75,10.03 v37.76,10.03
B64_L10_P  (via drill 0.3)
  Top 0.152: U$2.P$52 v41.29,46.25 | v38.99,10.13 39.65,9.47 J1.H16
  Bottom 0.152: v41.29,46.25 41.3,46.24 41.44,46.24 44.58,43.1 44.58,39.17 44.58,39.09 44.56,39.07 44.56,39.05 35.35,29.84 35.35,16.09 37.97,13.48 37.97,10.76 38.6,10.12 v38.99,10.12 v38.99,10.13
B64_L15_N  (via drill 0.3)
  Top 0.152: U$2.P$44 v41.33,42.25 | v35.15,10.05 35.73,9.47 J1.H19
  Bottom 0.152: v41.33,42.25 v41.33,42.24 41.48,42.24 42.12,41.6 42.12,40.06 32.91,30.85 32.91,12.47 34.27,11.12 34.27,10.94 v35.15,10.05
B64_L15_P  (via drill 0.3)
  Top 0.152: U$2.P$43 v40.9,41.75 | v33.96,10.08 34.56,9.47 J1.H20
  Bottom 0.152: v40.9,41.75 41.54,41.75 41.82,41.47 41.82,40.19 32.61,30.98 32.61,12.34 33.96,10.99 v33.96,10.08
B64_L16_N  (via drill 0.3)
  Top 0.152: U$2.P$53 v40.86,46.75 | v38.96,11.37 39.59,10.74 J1.G16
  Bottom 0.152: v40.86,46.75 40.91,46.75 40.93,46.73 41.52,46.73 44.89,43.37 44.89,39.04 44.89,38.96 44.87,38.94 44.87,38.93 35.66,29.72 35.66,16.21 38.27,13.6 38.27,12 38.91,11.36 v38.96,11.36 v38.96,11.37
B64_L16_P  (via drill 0.3)
  Top 0.152: U$2.P$54 v41.28,47.25 | v40.28,11.43 40.94,10.78 J1.G15
  Bottom 0.152: v41.28,47.25 41.29,47.24 41.45,47.24 45.19,43.5 45.19,38.92 45.19,38.83 45.17,38.81 45.17,38.8 36,29.63 36,16.3 38.57,13.73 38.57,12.13 38.79,11.91 39.16,11.91 39.63,11.44 v40.28,11.44 v40.28,11.43
B64_L19_N  (via drill 0.3)
  Top 0.152: U$2.P$45 v40.89,42.75 | v35.19,11.32 35.28,11.32 J1.G19
  Bottom 0.152: v40.89,42.75 41.53,42.75 42.45,41.83 42.45,39.97 42.43,39.95 42.43,39.94 33.22,30.73 33.22,12.59 34.5,11.31 v35.19,11.31 v35.19,11.32
B64_L19_P  (via drill 0.3)
  Top 0.152: U$2.P$46 v41.32,43.25 | v36.44,11.35 36.52,11.35 J1.G18
  Bottom 0.152: v41.32,43.25 v41.33,43.26 41.46,43.26 42.76,41.96 42.76,39.84 42.73,39.82 42.73,39.81 33.52,30.6 33.52,12.72 34.43,11.81 35.98,11.81 v36.44,11.35
B65_L1_N  (via drill 0.3)
  Top 0.152: U$2.P$3 v27.7,49.25 | v12.29,11.32 12.42,11.32 J1.G37
  Bottom 0.152: v27.7,49.25 27.7,49.01 27.64,48.95 27.64,48.7 26.61,47.68 26.61,47.29 24.65,45.32 21.86,45.32 15.29,38.75 15.29,21.32 12.33,18.36 12.33,17.22 12.99,16.55 12.99,14.5 11.85,13.35 11.85,11.73 12.27,11.31 v12.28,11.31 v12.29,11.32
B65_L6_N  (via drill 0.3)
  Top 0.152: U$2.P$27 v32.75,39.03 v32.75,39.02 | v25.1,15.21 25.7,14.62 J1.D27
  Bottom 0.152: v32.75,39.02 v32.74,39.01 32.74,37.84 24.91,30.02 24.91,15.38 25.08,15.21 v25.1,15.21
B65_L6_P  (via drill 0.3)
  Top 0.152: U$2.P$28 v33.25,38.55 | v26.3,15.19 26.33,15.19 J1.D26
  Bottom 0.152: v33.25,38.55 33.25,37.91 25.22,29.88 25.22,16.24 26.27,15.19 v26.3,15.19
B65_L9_N  (via drill 0.3)
  Top 0.152: U$2.P$41 v40.91,40.75 | v31.41,11.33 31.46,11.33 J1.G22
  Bottom 0.152: v40.91,40.75 40.91,40.19 32,31.28 32,11.91 v31.42,11.33 v31.41,11.33
B65_L9_P  (via drill 0.3)
  Top 0.152: U$2.P$42 v41.34,41.25 | v32.66,11.36 33.27,10.74 J1.G21
  Bottom 0.152: v41.34,41.25 41.51,41.08 41.51,40.36 32.3,31.15 32.3,11.71 v32.66,11.36
B65_L10_N  (via drill 0.3)
  Top 0.152: U$2.P$29 v33.75,39.02 | v26.29,16.47 25.7,15.88 J1.C27
  Bottom 0.152: v33.75,39.02 33.75,37.94 25.52,29.72 25.52,17.26 v26.3,16.48 v26.29,16.47
B65_L10_P  (via drill 0.3)
  Top 0.152: U$2.P$30 v34.25,38.59 | v27.55,16.48 26.96,15.89 J1.C26
  Bottom 0.152: v34.25,38.59 34.25,37.99 25.83,29.57 25.83,18.18 v27.54,16.47 v27.55,16.48
B65_L12_N  (via drill 0.3)
  Top 0.152: U$2.P$35 v36.75,39.04 v36.74,39.03 | v30.17,16.42 30.77,15.82 J1.C23
  Bottom 0.152: v36.74,39.03 36.74,38.29 27.35,28.9 27.35,20.51 28.2,19.66 28.2,19.41 30.17,17.44 v30.17,16.42
B65_L12_P  (via drill 0.3)
  Top 0.152: U$2.P$36 v37.25,38.61 v37.24,38.61 | v31.39,16.5 32.05,15.85 J1.C22
  Bottom 0.152: v37.24,38.61 37.24,38.34 27.66,28.75 27.66,20.68 31.39,16.95 v31.39,16.5
B65_L16_N  (via drill 0.3)
  Top 0.152: U$2.P$19 v27.62,41.25 | v17.47,11.36 16.86,10.74 J1.G34
  Bottom 0.152: v27.62,41.25 27.42,41.05 23.62,41.05 19.55,36.99 19.55,13.45 v17.47,11.36
B65_L16_P  (via drill 0.3)
  Top 0.152: U$2.P$20 v28.04,40.75 | v18.75,11.41 J1.G33
  Bottom 0.152: v28.04,40.75 23.75,40.75 19.86,36.86 19.86,13.28 18.75,12.17 v18.75,11.41
B65_L23_N  (via drill 0.3)
  Top 0.152: U$2.P$25 v31.75,39.03 v31.75,39.02 | v23.78,13.93 J1.E28
  Bottom 0.152: v31.75,39.02 v31.74,39.01 31.74,37.72 24.3,30.29 24.3,14.45 v23.79,13.93 v23.78,13.93
B65_L23_P  (via drill 0.3)
  Top 0.152: U$2.P$26 v32.25,38.6 | v25.02,13.92 25.66,13.29 J1.E27
  Bottom 0.152: v32.25,38.6 32.25,37.8 24.61,30.16 24.61,14.31 25,13.92 v25.02,13.92
B66_L8_N  (via drill 0.3)
  Top 0.152: U$2.P$55 v40.86,47.76 51.58,47.76 67,32.34 JP1.1 | v39.05,12.69 39.05,12.68 J1.F17
  Bottom 0.152: 45.5,38.79 | 45.5,38.79 45.5,38.71 45.48,38.69 45.48,38.67 36.3,29.5 36.3,16.43 38.88,13.86 38.88,12.85 v39.05,12.69 | 45.5,38.79 45.5,43.73 41.47,47.76 v40.86,47.76
B66_L8_P  (via drill 0.3)
  Top 0.152: U$2.P$56 v41.3,48.25 51.53,48.25 65.59,34.19 JP1.2 | v40.24,12.67 40.24,12.59 J1.F16
  Bottom 0.152: v41.3,48.25 41.41,48.25 45.8,43.85 45.8,38.66 45.8,38.58 45.78,38.56 45.78,38.55 36.61,29.38 36.61,16.56 39.18,13.98 39.18,13.3 39.8,12.68 v40.23,12.68 v40.24,12.67
B66_L15_N  (via drill 0.3)
  Top 0.152: U$2.P$49 v40.88,44.75 | v35.21,13.99 35.85,13.35 J1.E19
  Bottom 0.152: v40.88,44.75 41.56,44.75 43.67,42.64 43.67,39.55 43.67,39.47 43.65,39.45 43.65,39.43 34.44,30.22 34.44,15.67 35.21,14.9 v35.21,13.99
B66_L15_P  (via drill 0.3)
  Top 0.152: U$2.P$50 v41.31,45.25 | v36.45,13.86 36.55,13.86 J1.E18
  Bottom 0.152: v41.31,45.25 41.51,45.25 43.97,42.78 43.97,39.42 | 43.97,39.42 | 43.97,39.42 43.97,39.34 43.95,39.32 43.95,39.31 34.74,30.1 34.74,15.82 36.45,14.11 v36.45,13.86
B66_L20_P  (via drill 0.3)
  Top 0.152: U$2.P$57 v40.87,48.75 51.48,48.75 63.5,36.73 JP1.3 | v40.25,13.89 40.25,13.87 J1.E16
  Bottom 0.152: v40.87,48.75 41.25,48.75 41.27,48.73 41.53,48.73 46.11,44.15 46.11,38.54 | 46.11,38.54 | 46.11,38.54 46.11,38.45 46.09,38.44 46.09,38.42 36.91,29.25 36.91,16.68 39.71,13.89 v40.25,13.89
B66_L24_N  (via drill 0.3)
  Top 0.152: U$2.P$48 v41.35,44.25 v41.35,44.24 | v36.41,12.67 36.41,12.57 J1.F19
  Bottom 0.152: v41.35,44.24 v41.36,44.25 41.5,44.25 43.37,42.39 43.37,39.67 43.36,39.67 43.36,39.59 43.34,39.57 43.34,39.56 34.13,30.35 34.13,14.37 35.83,12.67 v36.41,12.67
B66_L24_P  (via drill 0.3)
  Top 0.152: U$2.P$47 40.38,43.76 v40.91,43.76 | v35.12,12.65 35.12,12.55 J1.F20
  Bottom 0.152: v40.91,43.76 41.15,43.76 41.16,43.76 41.53,43.76 43.06,42.23 43.06,39.8 | 43.06,39.8 | 43.06,39.8 43.06,39.72 43.04,39.7 43.04,39.69 33.83,30.48 33.83,13.09 34.27,12.65 v35.12,12.65
B228_RX0_N  (via drill 0.3)
  Top 0.152: U$2.P$78 v30.75,52.27 v30.74,52.28 | v50.41,16.45 51.03,15.82 J1.C7
  Bottom 0.152: v30.74,52.28 v30.75,52.28 30.75,52.61 34.6,56.46 44.36,56.46 50.69,50.14 50.69,16.73 v50.41,16.45
B228_RX0_P  (via drill 0.3)
  Top 0.152: U$2.P$79 v30.25,51.84 | v51.72,16.45 52.34,15.82 J1.C6
  Bottom 0.152: v30.25,51.84 v30.26,51.85 30.26,52.58 34.45,56.77 44.48,56.77 50.99,50.26 50.99,42.91 51,42.9 51,17.1 51.65,16.45 v51.72,16.45
B228_RX1_P  (via drill 0.35)
  Top 0.305: R1.2 62.49,44.44 R2.1 v60.7,42.55 v60.69,42.54 | v58.08,19.05 57.45,18.41 J1.A2
  Bottom 0.305: v60.69,42.54 60.69,21.66 v58.08,19.05
B228_RX2_N  (via drill 0.3)
  Top 0.152: U$2.P$80 v29.75,52.27 v29.76,52.27 | v51.62,19 51.09,18.48 J1.A7
  Bottom 0.152: v29.76,52.27 29.76,52.51 34.32,57.07 44.61,57.07 51.29,50.39 51.29,43.03 51.3,43.02 51.3,19.32 v51.62,19
B228_TX1_N  (via drill 0.3)
  Top 0.152: U$2.P$37 v37.75,39.04 | v30.17,19.06 30.77,18.45 J1.A23
  Bottom 0.152: v37.75,39.04 v37.74,39.03 37.74,38.41 27.96,28.62 27.96,20.81 29.71,19.06 v30.17,19.06
B228_TX2_N  (via drill 0.3)
  Top 0.152: U$2.P$31 v34.75,39.02 | v26.31,19.24 25.7,18.63 J1.A27
  Bottom 0.152: v34.75,39.02 34.75,38.05 26.13,29.43 26.13,19.42 v26.31,19.24
B228_TX2_P  (via drill 0.3)
  Top 0.152: U$2.P$32 v35.25,38.6 | v27.02,19.24 26.96,19.18 J1.A26
  Bottom 0.152: v35.25,38.6 35.25,38.12 26.44,29.31 26.44,19.87 27.02,19.29 v27.02,19.24
B228_TX3_N  (via drill 0.3)
  Top 0.152: U$2.P$21 v29.75,39.05 | v20.48,19.53 20.61,19.39 J1.A31
  Bottom 0.152: v29.75,39.05 29.75,37.53 23.08,30.86 23.08,22.13 v20.48,19.53
B228_TX3_P  (via drill 0.3)
  Top 0.152: U$2.P$22 v30.25,38.62 v30.24,38.62 | v21.86,19.52 21.89,19.5 J1.A30
  Bottom 0.152: v30.24,38.62 30.25,38.61 30.25,37.58 23.39,30.72 23.39,22 21.86,20.48 v21.86,19.52
B229_RX2_N  (via drill 0.3)
  Top 0.152: U$2.P$62 v38.75,51.89 | J1.B17 38.49,17.09 v39.06,17.66
  Bottom 0.152: v38.75,51.89 v38.76,51.88 39.02,51.88 46.41,44.48 46.41,38.41 46.41,38.33 46.39,38.31 46.39,38.3 40.72,32.62 40.72,18.83 39.55,17.66 v39.06,17.66
B229_RX2_P  (via drill 0.3)
  Top 0.152: U$2.P$63 38.23,51.37 v38.23,52.29 | v40.31,17.66 40.23,17.66 J1.B16
  Bottom 0.152: v38.23,52.29 38.3,52.37 38.96,52.37 46.72,44.61 46.72,38.28 46.72,38.2 46.7,38.18 46.7,38.17 41.02,32.5 41.02,18.09 40.59,17.66 v40.31,17.66
B229_RX3_N  (via drill 0.3)
  Top 0.152: U$2.P$70 v34.75,52.3 | v42.79,17.69 43.38,17.09 J1.B13
  Bottom 0.152: v34.75,52.3 34.75,52.44 34.89,52.57 36.33,54.02 39.5,54.02 47,46.51 47,46.49 48.24,45.25 48.24,37.52 42.62,31.9 42.62,17.86 v42.79,17.69
B229_RX3_P  (via drill 0.3)
  Top 0.152: U$2.P$71 v34.25,51.85 v34.26,51.86 | v44.05,17.74 44.1,17.74 J1.B12
  Bottom 0.152: v34.26,51.86 34.26,52.52 36.07,54.33 39.62,54.33 45,48.95 45,48.94 47.3,46.64 47.3,46.62 48.55,45.38 48.55,37.39 42.92,31.77 42.92,19.27 44.05,18.15 v44.05,17.74
B229_TX0_N  (via drill 0.3)
  Top 0.152: U$2.P$11 v27.66,45.25 v27.66,45.24 | v16.04,19.22 15.54,18.71 J1.A35
  Bottom 0.152: v27.66,45.24 27.47,45.05 27.25,45.05 25.69,43.49 22.61,43.49 17.12,38 17.12,20.3 v16.04,19.22
B229_TX0_P  (via drill 0.3)
  Top 0.152: U$2.P$12 v28.09,44.75 | v16.81,19.2 J1.A34
  Bottom 0.152: v28.09,44.75 27.38,44.75 25.82,43.19 22.74,43.19 17.42,37.87 17.42,20.04 16.8,19.42 v16.8,19.2 v16.81,19.2
B229_TX2_N  (via drill 0.3)
  Top 0.152: U$2.P$9 v27.67,46.25 v27.66,46.26 | v13.74,17.78 13.68,17.78 J1.B37
  Bottom 0.152: v27.66,46.26 27.46,46.05 27.25,46.05 25.3,44.1 22.36,44.1 16.51,38.25 16.51,20.81 14.61,18.91 14.61,18.62 v13.75,17.77 v13.74,17.78
B229_TX2_P  (via drill 0.3)
  Top 0.152: U$2.P$10 v28.08,45.75 | v14.91,17.79 14.91,17.74 J1.B36
  Bottom 0.152: v28.08,45.75 27.38,45.75 25.43,43.8 22.49,43.8 16.81,38.12 16.81,20.68 14.91,18.78 v14.91,17.79
B229_TX3_N  (via drill 0.3)
  Top 0.152: U$2.P$13 v27.65,44.25 | J1.B33 18.07,16.95 v17.53,16.41
  Bottom 0.152: v27.65,44.25 27.46,44.05 27.19,44.05 26.02,42.88 22.87,42.88 17.73,37.74 17.73,19.88 17.29,19.44 17.29,16.65 v17.53,16.41
B229_TX3_P  (via drill 0.3)
  Top 0.152: U$2.P$14 v28.08,43.75 | v17.82,19.24 18.18,19.24 18.71,18.71 18.71,17.73 J1.B32
  Bottom 0.152: v28.08,43.75 27.32,43.75 26.15,42.58 22.99,42.58 18.03,37.62 18.03,19.46 v17.82,19.25 v17.82,19.24
B230_RX0_N  (via drill 0.3)
  Top 0.152: U$2.P$76 v31.75,52.3 | v47.85,17.66 48.41,17.09 J1.B9
  Bottom 0.152: v31.75,52.3 31.75,52.49 35.12,55.85 40.19,55.85 | 40.19,55.85 | 40.19,55.85 40.25,55.85 46.91,49.19 46.91,49.18 48.83,47.27 48.83,47.25 50.07,46.01 50.07,36.76 44.47,31.16 44.47,19.89 45.93,18.43 45.93,18.07 46.32,17.68 47.83,17.68 v47.85,17.66
B230_RX0_P  (via drill 0.3)
  Top 0.152: U$2.P$77 v31.25,51.86 | v49.21,17.76 49.83,17.14 J1.B8
  Bottom 0.152: v31.25,51.86 31.25,52.66 34.75,56.16 44.23,56.16 50.38,50.01 50.38,18.9 49.24,17.76 v49.21,17.76
B230_TX0_N  (via drill 0.3)
  Top 0.152: U$2.P$23 v30.75,39.04 v30.75,39.03 | v22.52,17.72 23.14,17.09 J1.B29
  Bottom 0.152: v30.75,39.03 v30.74,39.02 30.74,37.63 23.69,30.58 23.69,21.88 22.53,20.72 v22.53,17.72 v22.52,17.72
B230_TX0_P  (via drill 0.3)
  Top 0.152: U$2.P$24 v31.25,38.6 | v23.76,17.73 24.39,17.09 J1.B28
  Bottom 0.152: v31.25,38.6 31.25,37.67 24,30.42 24,22.1 23.99,22.09 23.99,21.75 23.76,21.52 v23.76,17.73
B230_TX1_N  (via drill 0.3)
  Top 0.152: U$2.P$33 v35.75,39.03 | v27.59,17.69 28.18,17.09 J1.B25
  Bottom 0.152: v35.75,39.03 35.73,39.01 35.73,38.15 26.74,29.16 26.74,20.26 27.59,19.41 v27.59,17.69
B230_TX1_P  (via drill 0.3)
  Top 0.152: U$2.P$34 v36.25,38.6 | v28.85,17.76 29.5,17.11 J1.B24
  Bottom 0.152: v36.25,38.6 36.25,38.23 27.05,29.03 27.05,20.38 27.89,19.54 27.89,18.71 v28.85,17.76
GND  (via drill 0.3)
  Top 0.152: J1.K39 J1.J38 J1.H39 | J1.H39 J1.J40 | J1.H39 J1.G38 J1.F39 | J1.K36 J1.J35 J1.H36 J1.G35 J1.F36 J1.E35 J1.D35 | J1.D37 J1.E38 J1.D39 J1.E40 | J1.C38 J1.B38 | J1.B38 J1.B39 J1.A40 | J1.C32 J1.C33 J1.C34 J1.B34 J1.B35 J1.C36 | J1.C32 J1.B31 | J1.E32 J1.F33 | J1.B38 J1.A37 | J1.B31 J1.A32 | J1.B31 J1.B30 J1.C29 | J1.C29 J1.C28 | J1.C28 J1.B27 | J1.B27 J1.A28 | J1.B27 J1.B26 | J1.D28 J1.C28 | J1.C29 23.16,15.33 22.61,14.78 22.61,14.33 23.16,13.78 J1.E29 J1.F30 J1.G29 J1.H30 J1.J29 J1.K30 | J1.K33 J1.J32 J1.H33 J1.G32 19.34,11.24 19.89,11.79 19.89,12.24 19.34,12.79 J1.E32 | J1.E32 19.34,13.78 19.89,14.33 19.89,14.78 19.34,15.33 J1.C32 | J1.K27 J1.J26 J1.H27 J1.G26 J1.F27 J1.E26 J1.D25 J1.C25 J1.C24 | J1.A24 J1.B23 J1.B22 | J1.B22 J1.A21 | J1.A20 J1.B19 | J1.B19 J1.C20 J1.C21 | J1.C21 J1.D22 | J1.C21 J1.B22 | J1.D22 J1.E23 J1.F24 J1.G23 J1.H24 J1.J23 J1.K24 | J1.K21 J1.J20 J1.H21 | J1.G20 J1.F21 J1.E20 33.86,14.01 33.09,14.01 32.54,14.55 J1.D22 | J1.K18 J1.J17 J1.H18 | J1.K15 J1.J14 J1.H15 J1.G14 J1.F15 J1.E14 J1.D13 J1.C13 | J1.G17 J1.F18 J1.E17 J1.D16 J1.C16 J1.C17 | J1.D19 36.58,15.28 37.35,15.28 37.9,15.82 J1.C17 | J1.B19 J1.B18 | J1.B18 J1.C17 | J1.B18 J1.A17 | J1.C13 J1.C12 | J1.C13 J1.B14 J1.B15 | J1.K12 J1.J11 J1.H12 J1.G11 J1.F12 J1.E11 J1.D10 J1.C9 | J1.C9 J1.C8 | J1.C9 J1.B10 J1.B11 | J1.K9 J1.J8 J1.H9 J1.G8 J1.F9 J1.E8 J1.D7 J1.D6 | J1.D6 J1.C5 J1.B6 | J1.D6 J1.E5 J1.F6 J1.G5 J1.H6 J1.J5 | J1.J5 J1.K6 | J1.J5 J1.J4 | J1.J4 J1.K3 | J1.K2 J1.J1 | J1.J4 J1.H3 J1.G4 J1.F3 J1.E4 J1.D3 J1.C4 J1.B3 J1.A4 | J1.G1 J1.F2 J1.E1 J1.D2 J1.C1 J1.B2 J1.A1 | J1.B6 J1.A5 | J1.B6 J1.B7 J1.A8
  Top 0.203: J1.B34 J1.A33
  Top 0.305: U$2.P$5 28.62,48.23 28.45,48.23 28.08,47.86 v27.98,47.86 | U$2.P$65 37.23,51.37 37.23,51.54 36.96,51.81 v36.96,51.92
  Bottom 0.305: v27.98,47.86 32.14,47.86 v33.49,46.51 | v36.96,51.92 36.96,47.98 v35.49,46.51
  other vias: 34.49,45.51 35.49,44.51 33.49,44.51 33.48,45.5 34.49,44.52 35.5,45.51 34.51,46.51
  pour Bottom (isolate 0.254): 0,0 0,89.04 69,89.04 69,0
  pour Top: 0,0 0,89 69,89 69,0
N$2
  Top 0.508: R1.1 63.98,48.73 61.33,48.73 59.43,50.63 59.43,51.56 60,52.13 60,52.15 60.22,52.37 U$1.2 61.21,52.37 61.91,53.06 61.91,54.2 61.2,54.91 U$1.4
VADJ
  Top 0.152: J1.H40 J1.G39 J1.F40 J1.E39
VDD_1.8
  Top 0.508: 60.87,69.72 C1.1 61.59,69.74 66.91,64.42 66.91,54.02 63.96,51.07 60.65,51.07 U$1.1
  Top 1.27: VDD.P$1 60,70.62 C1.1 | 60.87,69.72 60.59,70 C5.1
VDD_3.3  (via drill 0.55)
  Top 0.508: U$1.3 59.23,53.63 58.69,54.18 58.69,56.52 v58.65,56.56 58.68,56.53 58.68,50.33 60.7,48.31 R2.2 | U$4.P$1 26,73.83 22.17,70 C6.1 15.65,69.65 C2.1 15.41,66 v16,66
  Bottom 0.508: v16,66 44.05,66 53.49,56.56 v58.65,56.56
VDD_CORE  (via drill 0.35)
  Top 0.305: U$2.P$6 28.66,47.77 28.84,47.77 29.22,48.16 29.22,49.01 39.96,49.01 40.17,49.23 40.34,49.23 U$2.P$58 | U$1.7 54.76,51.75 v53.9,51.75
  Top 0.508: 52.37,53.33 C4.1 52.37,55.73 50.61,57.48 50.61,60.32 C8.+ | U$1.8 U$1.7 54.97,52.37 54,53.33 52.37,53.33 | 52.37,53.33 47.28,53.33 45.98,54.63 41.37,54.63 41,55 31,55 29,53 29,50.7 29.22,50.49 29.22,49.01
  Bottom 0.305: v53.9,51.75 61.3,44.35 JP1.6
VDD_IO  (via drill 0.35)
  Top 0.305: U$2.P$66 36.77,51.33 36.77,51.15 37.54,50.39 39.35,50.39 38.88,49.92 v38.88,49.59 | v38.26,40.43 U$2.P$38 | 54,50.39 55,49.39 v55,49
  Top 0.508: 39.35,50.39 39.79,50.83 53.33,50.83 53.77,50.39 54,50.39 56.33,50.39 56.57,50.63 56.57,52.83 56.33,53.07 55.94,53.07 U$1.6 U$1.5 55.45,54.91 57.95,57.41 C3.1 61.43,62.16 C7.+
  Bottom 0.305: v38.88,49.59 38.88,41.05 v38.26,40.43 | v55,49 56,49 61.11,43.89 64.92,43.89 JP1.5

### Text on the board
tNames: GF130nm testbed V2 | February 2021